# EAGLE schematic bpf-UHF-SAW-SF2446E (EAGLE 9.2.2)
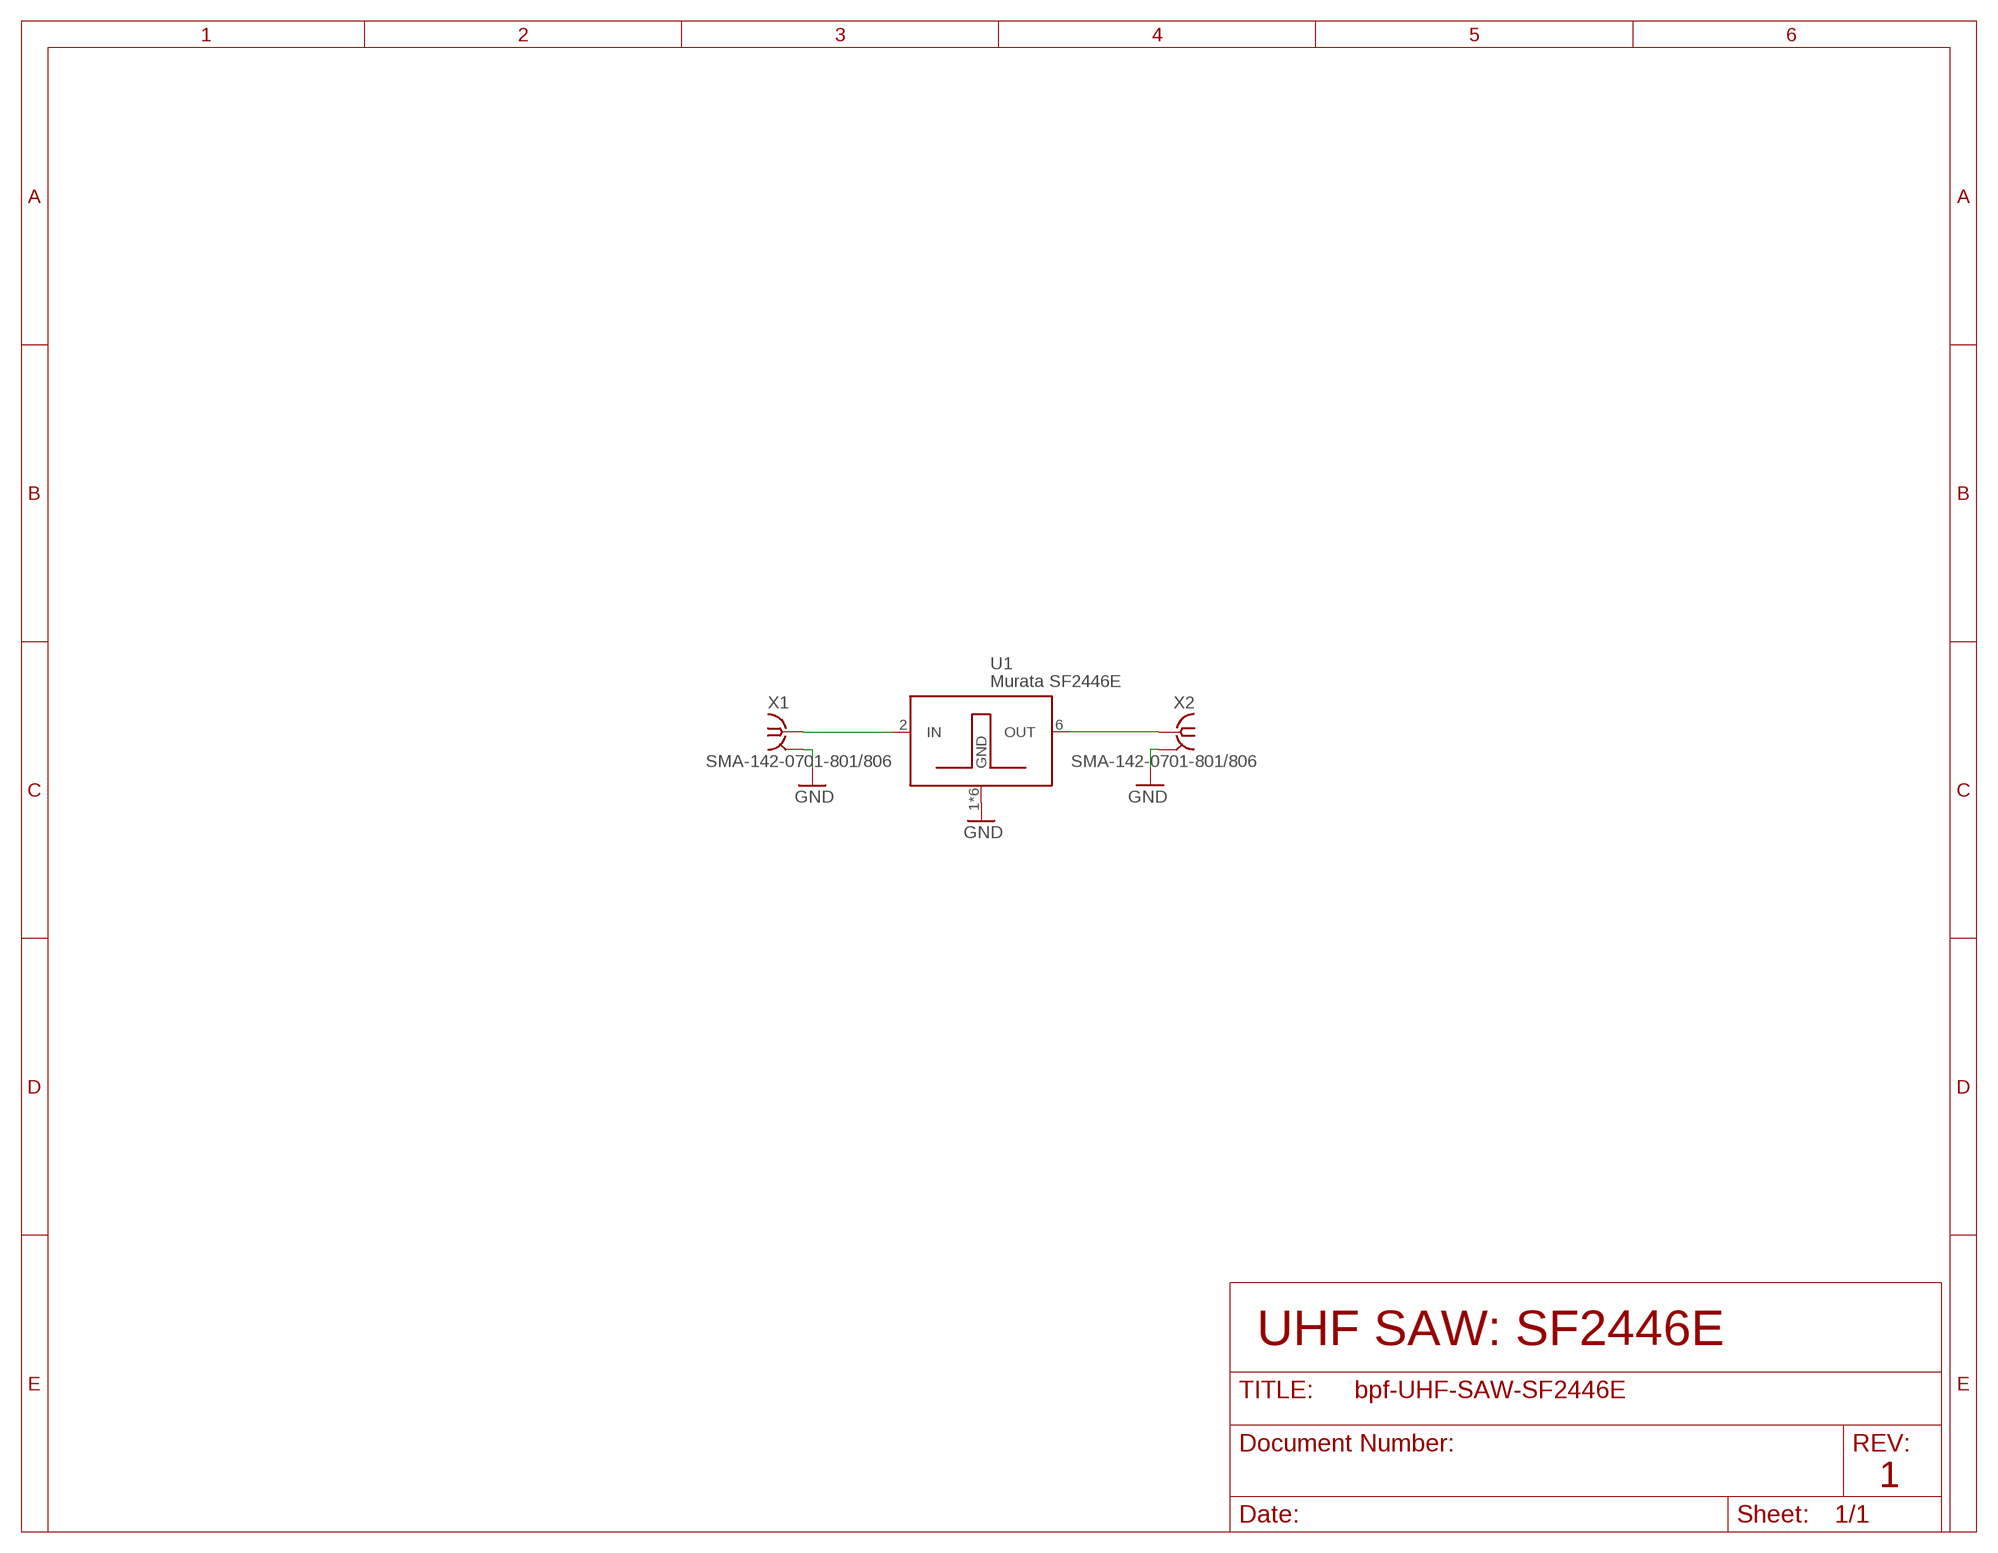
[diagram p0: schematic, sheet 1]

## Parts
U1  Murata SF2446E  856930  [3.8X3.8]
X1  SMA-142-0701-801/806  [J502-ND-142-0701-801/806]
X2  SMA-142-0701-801/806  [J502-ND-142-0701-801/806]

## Nets
GND: U1.1(GND) U1.3(GND) U1.4(GND) U1.5(GND) U1.7(GND) U1.8(GND) X1.G@1 X1.G@2 X1.G@3 X1.G@4 X2.G@1 X2.G@2 X2.G@3 X2.G@4
N$57: U1.2(IN) X1.1
N$88: U1.6(OUT) X2.1

## Notes on the sheet
- UHF SAW: SF2446E
- 1

## Library data of the parts
U1 = U-Qorvo-856930-SAW:856930: 457.5 MHz SAW Filter
X1 X2 = con-coax:SMA-: SMA 50 Ohm End Launch Jack Receptacle - Round Contact Johnson Components Source: www.johnsoncomponents.com .. J502-ND.pdf; MF: JOHNSON COMPONENTS; MPN: 142-0701-801; OC_FARNELL: 1608592; OC_NEWARK: 90F2624